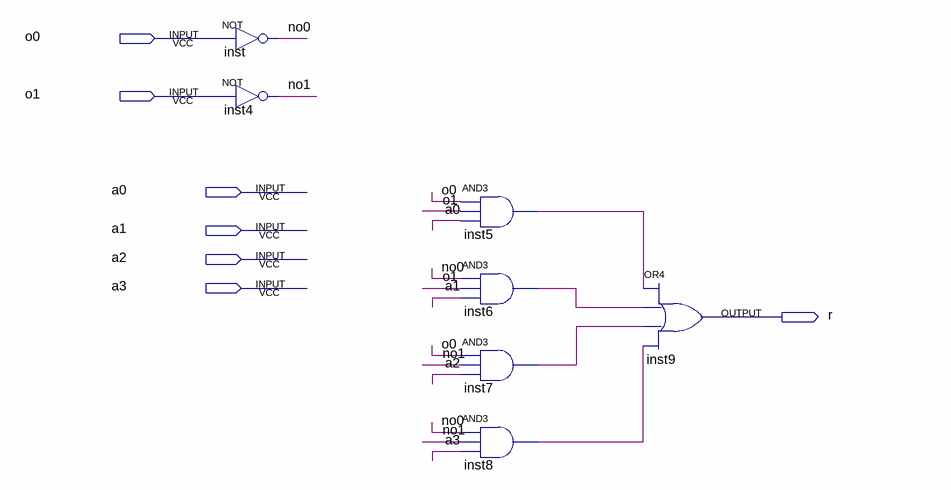
[diagram p0: schematic sheet]
// Quartus schematic mux.bdf as structural Verilog: 7 symbols, 7 pins
module mux (
  input  o0,
  input  o1,
  input  a0,
  input  a1,
  input  a2,
  input  a3,
  output r
);

  wire inst5_out, inst6_out, inst7_out, inst8_out, no0, no1;

  not inst (no0, o0);
  not inst4 (no1, o1);
  and inst5 (inst5_out, o0, o1, a0);
  and inst6 (inst6_out, no0, o1, a1);
  and inst7 (inst7_out, o0, no1, a2);
  and inst8 (inst8_out, no0, no1, a3);
  or inst9 (r, inst5_out, inst6_out, inst7_out, inst8_out);
endmodule
